# EAGLE design tweeq-Stamp_RTC_DS1337 (EAGLE 6.4)
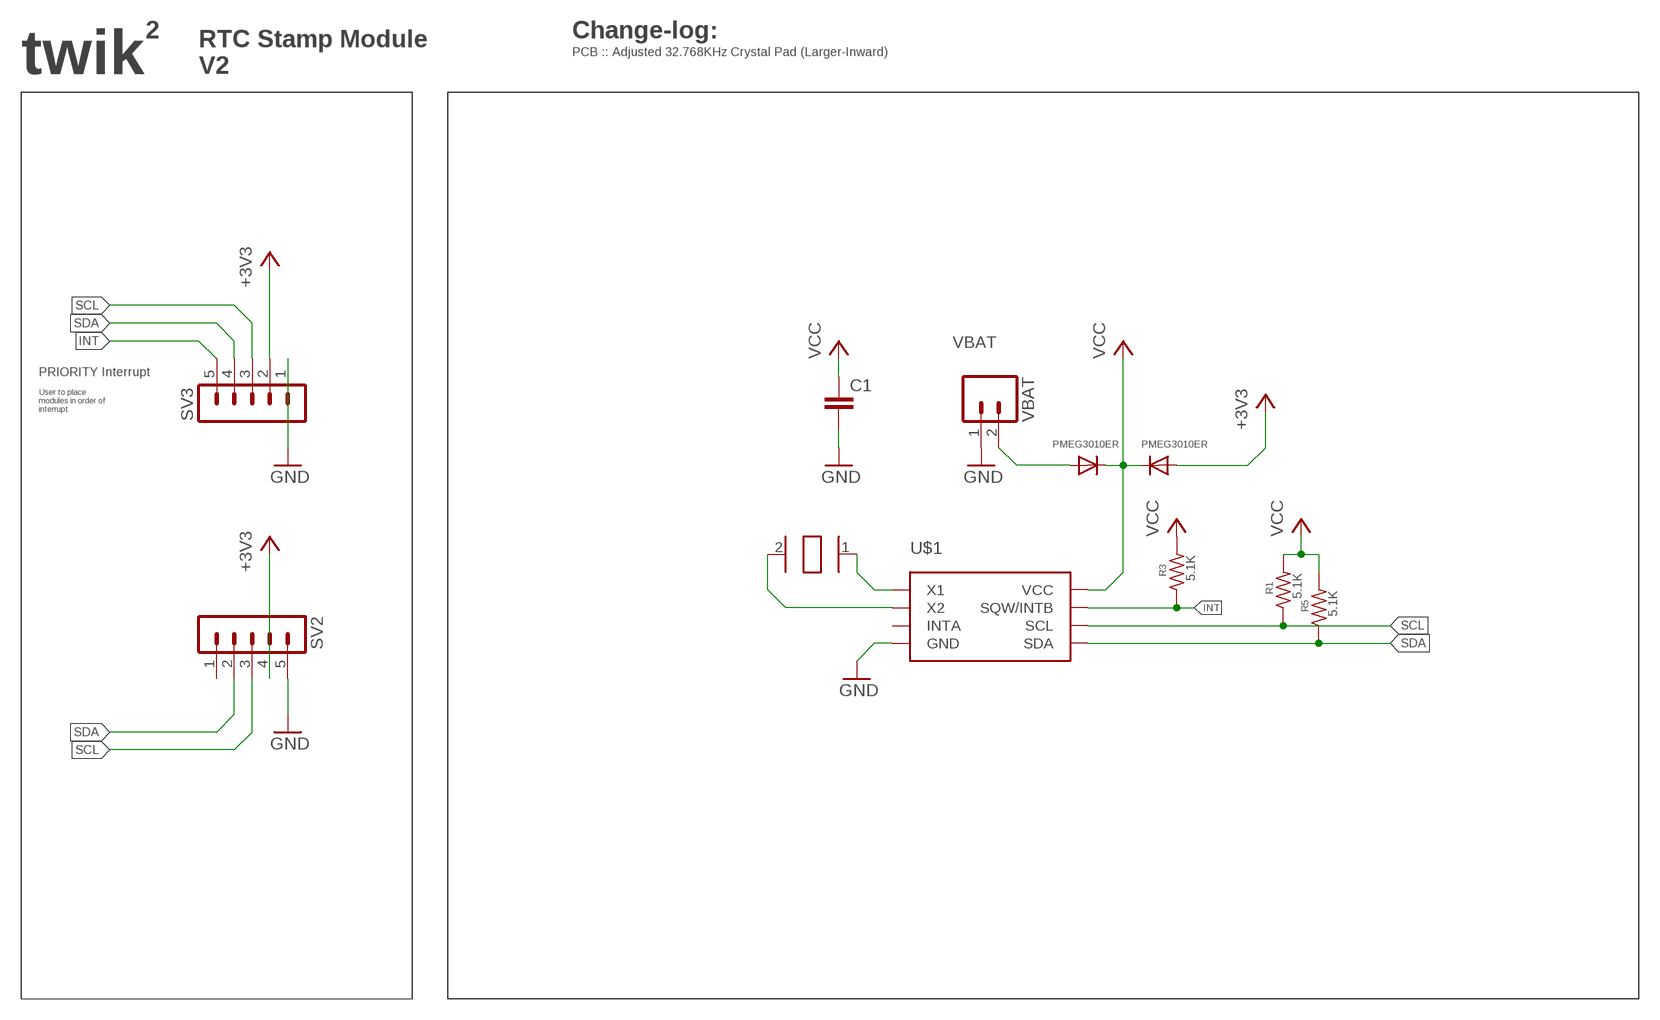
[diagram p0: schematic, sheet 1]

## Parts
C1  C-EUC0402K  [C0402K]
R1  5.1K  R-US_R0402  [R0402]
R3  5.1K  R-US_R0402  [R0402]
R5  5.1K  R-US_R0402  [R0402]
SV2  M05-1STAMP  [1X05-1.5MM-STAMP]
SV3  M05-1STAMP  [1X05-1.5MM-STAMP]
U$1  DS1337SO  [MSOP8]
U$2  32.765KHZ_CRYSTALABS07  [ABS07]
U$4  PMEG3010ER/MOD  [SOD123-MOD]
U$6  PMEG3010ER/MOD  [SOD123-MOD]
VBAT  M021X02_SMD_SQUARE  [1X02_SMD]

## Nets
+3V3: SV2.4 SV3.2 U$6.A
GND: C1.2 SV2.5 SV3.1 U$1.4(GND) VBAT.1
INT: R3.1 SV3.5 U$1.7(SQW/INTB)
N$2: U$1.2(X2) U$2.2
N$3: U$1.1(X1) U$2.1
SCL: R1.1 SV2.3 SV3.3 U$1.6(SCL)
SDA: R5.1 SV2.2 SV3.4 U$1.5(SDA)
VBAT: U$4.A VBAT.2
VCC: C1.1 R1.2 R3.2 R5.2 U$1.8(VCC) U$4.C U$6.C
Unconnected: SV2.1 U$1.3(INTA)

## Notes on the sheet
- 2 | Change-log:
- PCB :: Adjusted 32.768KHz Crystal Pad (Larger-Inward)
- twik
- RTC Stamp Module
  V2
- VBAT
- PRIORITY Interrupt
- User to place 
  modules in order of 
  interrupt
- PMEG3010ER | PMEG3010ER

## Library data of the parts
C1 = AISCube:C-EU: CAPACITOR, European symbol
R1 R3 R5 = rcl:R-US_: RESISTOR, American symbol
SV2 SV3 = AISCube:M05-1: PIN HEADER Standard 0.1" header pin 5 pins - 1 way
U$1 = AISCube:DS1337: DS1337 RTC, 2 programmable alarms. I2C interface
U$2 = AISCube:32.765KHZ_CRYSTAL: 32.768KHZ CRYSTAL
U$4 U$6 = AISCube:PMEG3010ER: Schottky Barrier Rectiﬁer PMEG3010ER 1 A low VF MEGA Schottky barrier rectiﬁer
VBAT = AISCube:M02: Header 2 Standard 2-pin 0.1" header. Use with straight break away headers (SKU : PRT-00116), right angle break away headers (PRT-00553), swiss pins (PRT-00743), machine pins (PRT-00117), and female headers (PRT-00115). Molex polarized connector foot print use with SKU : PRT-08233 with associated crimp pins and housings.

## Board
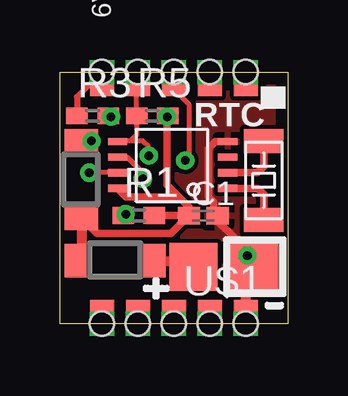
[diagram p1: board, top side]
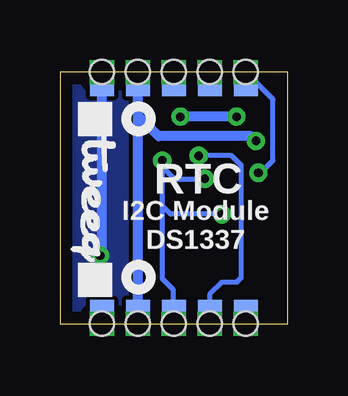
[diagram p2: board, bottom side, seen from below]

Size 9.5 x 10.5 mm. Coordinates in mm from the lower left corner, seen from the top.
Outline: 0,10.5 9.5,10.5 9.5,0 0,0 0,10.5
Copper layers (1*16): Top 0.0356mm / dielectric 1.5011mm / Bottom 0.0356mm
Design rules "AISCube": minimum track width 7mil, minimum drill 14mil, track to track 7mil, track to pad 7mil, pad to pad 7mil, via to via 7mil, smd to smd 0mil, copper to edge 20mil, drill to drill 8mil, minimum pad ring 10mil, minimum via ring 8mil, stop-mask expansion 4mil, vias tented up to drill 32mil, thermal gap 10mil

### Footprints (pad centres in the part's own frame; a part is rotated, then mirrored left to right if it is on the bottom)
C0402K = smd 0.925 x 0.74: 1 -0.6,0; 2 0.6,0
R0402 = smd 0.9 x 0.7: 1 -0.65,0; 2 0.65,0
1X05-1.5MM-STAMP = drill 0.5 pad 1 square: 1 -3,0; 2 -1.5,0; 3 0,0; 4 1.5,0; 5 3,0 | smd 1 x 0.6: P$1 -3,0.7; P$2 -1.5,0.7; P$3 0,0.7; P$4 1.5,0.7; P$5 3,0.7 | smd 1 x 0.6 bottom: P$6 -3,0.7; P$7 -1.5,0.7; P$8 0,0.7; P$9 1.5,0.7; P$10 3,0.7 | hole 1: -3,0; -1.5,0; 0,0; 1.5,0; 3,0
MSOP8 = smd 0.8 x 0.3: 1 -2.1,-0.55; 2 -2.1,-1.2; 3 -2.1,-1.85; 4 -2.1,-2.5; 5 2.5,-2.5; 6 2.5,-1.85; 7 2.5,-1.2; 8 2.5,-0.55
ABS07 = smd 1 x 1.65: 1 -1.65,0.05; 2 1.65,0.05
SOD123-MOD = smd 1 x 1.4: A 1.5,-0.035; C -1.7,-0.035
1X02_SMD = smd 2 x 2: 1 -1.27,0; 2 1.27,0

### Placement (x,y rotation side)
C1  5.99,4.51 0 top
R1  3.29,4.51 0 top
R3  1.36,8.67 0 top
R5  3.85,8.67 0 top
SV2  4.75,0 0 top
SV3  4.75,10.5 180 top
U$1  4.9,5.1 180 top
U$2  8.55,5.98 90 top
U$3  [TWEEQ-LOGO-S]  9.04,7.92 270 bottom
U$4  2.4,2.66 0 top
U$6  0.86,6.12 90 top
VBAT  6.85,2.37 180 top

### Tracks (layer width: path | path; a pad name or v marks a point on that pad's centre or on a via)
+3V3  (via drill 0.36)
  Top 0.406: U$6.A v1.32,7.62
  Bottom 0.406: SV2.4 6.25,8.69 | SV3.2 6.25,8.84 6.25,8.69 | v1.32,7.62 1.52,7.82 5.38,7.82 6.25,8.69
GND  (via drill 0.36)
  Top 0.305: 6.6,4.52 6.6,4.27 7.32,3.56 7.32,2.37 7.75,1.93 | U$1.4 6.48,7.6 6.2,7.32 6.2,5.28 6.4,5.08 6.4,4.69 C1.2
  Top 0.406: SV2.5 7.75,1.93 7.75,2 VBAT.1 7.82,2.67 v7.82,2.85 | C1.2 6.6,4.52
  Bottom 0.406: SV3.1 7.75,2.92 v7.82,2.85
  pour Top: 9.3,10.3 9.3,0.18 0.15,0.18 0.15,10.3
  pour Bottom: 9.3,0.18 9.3,10.3 0.15,10.3 0.15,0.18
INT  (via drill 0.36)
  Top 0.203: U$1.7 2.5,6.3 v1.22,6.3
  Top 0.254: SV3.5 0.71,9.46 R3.1
  Bottom 0.203: SV3.5 0.61,9.36 0.61,6.81 1.12,6.3 v1.22,6.3
N$2
  Top 0.305: U$1.2 8.24,6.3 8.51,6.56 U$2.2
N$3
  Top 0.305: U$1.1 8.26,5.65 8.51,5.4 U$2.1
SCL  (via drill 0.36)
  Top 0.203: SV3.3 4.75,9.78 5.38,9.14 5.38,6.96 v5.23,6.81 | 2.5,4.51 R1.1 2.74,4.61 v2.74,4.57 | U$1.6 2.81,6.95 3.45,6.3 v3.45,6.04
  Bottom 0.203: v2.74,4.57 4.88,4.57 5.23,4.93 | 5.23,4.93 v5.23,6.81 5.23,6.55 4.72,6.04 v3.45,6.04 | 5.23,4.93 5.23,1.88 4.78,1.42 4.78,0.03 SV2.3
SDA  (via drill 0.36)
  Top 0.203: 2.95,7.62 3.45,7.62 3.71,7.37 v3.71,7.01 | 2.95,7.62 2.42,7.62 U$1.5 | 2.95,7.62 3.2,7.88 R5.1 3.2,10.45
  Top 0.254: SV3.4 3.2,10.45
  Bottom 0.203: SV2.2 3.25,1.22 2.74,1.73 2.13,1.73 1.93,1.93 1.93,6.6 2.34,7.01 v3.71,7.01
VBAT
  Top 0.406: U$4.A 5.33,2.62 VBAT.2
VCC  (via drill 0.36)
  Top 0.305: C1.1 3.95,4.51 R1.2 | C1.1 4.64,3.76 1.56,3.76 U$6.C | 4.37,8.53 v4.47,8.64 4.47,5.79 4.98,5.28 | C1.1 5.39,4.88 4.98,5.28 | U$1.8 2.77,5.28 4.98,5.28
  Top 0.406: U$6.C 0.9,2.93 U$4.C | C1.1 | R3.2 2.05,8.64 v2.13,8.64 | v4.47,8.64 R5.2 4.5,8.47
  Bottom 0.406: v2.13,8.64 v4.47,8.64

### Text on the board
tPlace: RTC
bPlace: RTC | I2C Module / DS1337
tNames: 6V-9V DC | ON
bNames: Breadboard | V-Reg | Module